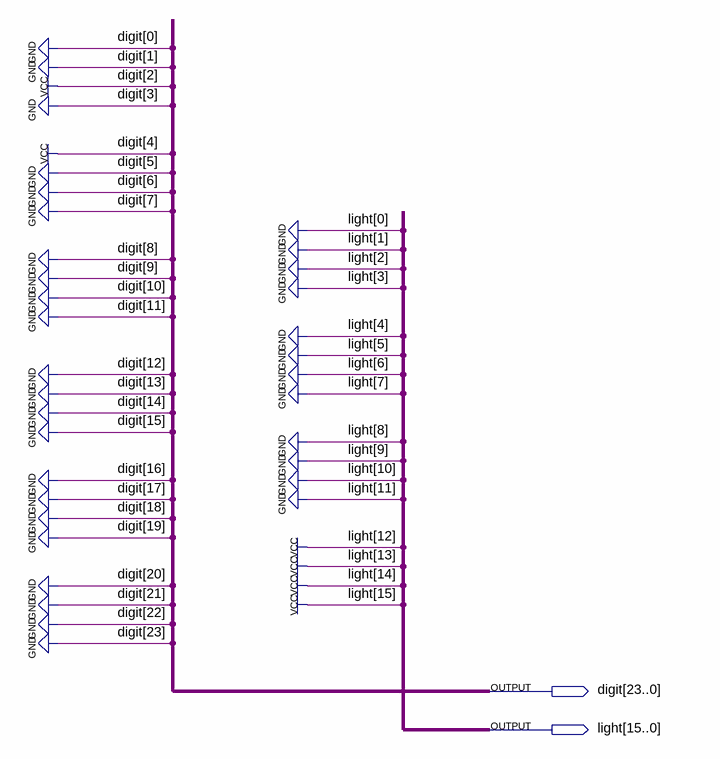
[diagram p0: schematic sheet]
// Quartus schematic Pattern_2_Frame_13.bdf as structural Verilog: 0 symbols, 2 pins
module Pattern_2_Frame_13 (
  output [23:0] digit,
  output [15:0] light
);


  assign digit = 24'b000000000000000000010100;
  assign light = 16'b1111000000000000;
endmodule
